# Altium schematic sheet Schematic-Altium.schdoc
size 677 x 232 mm
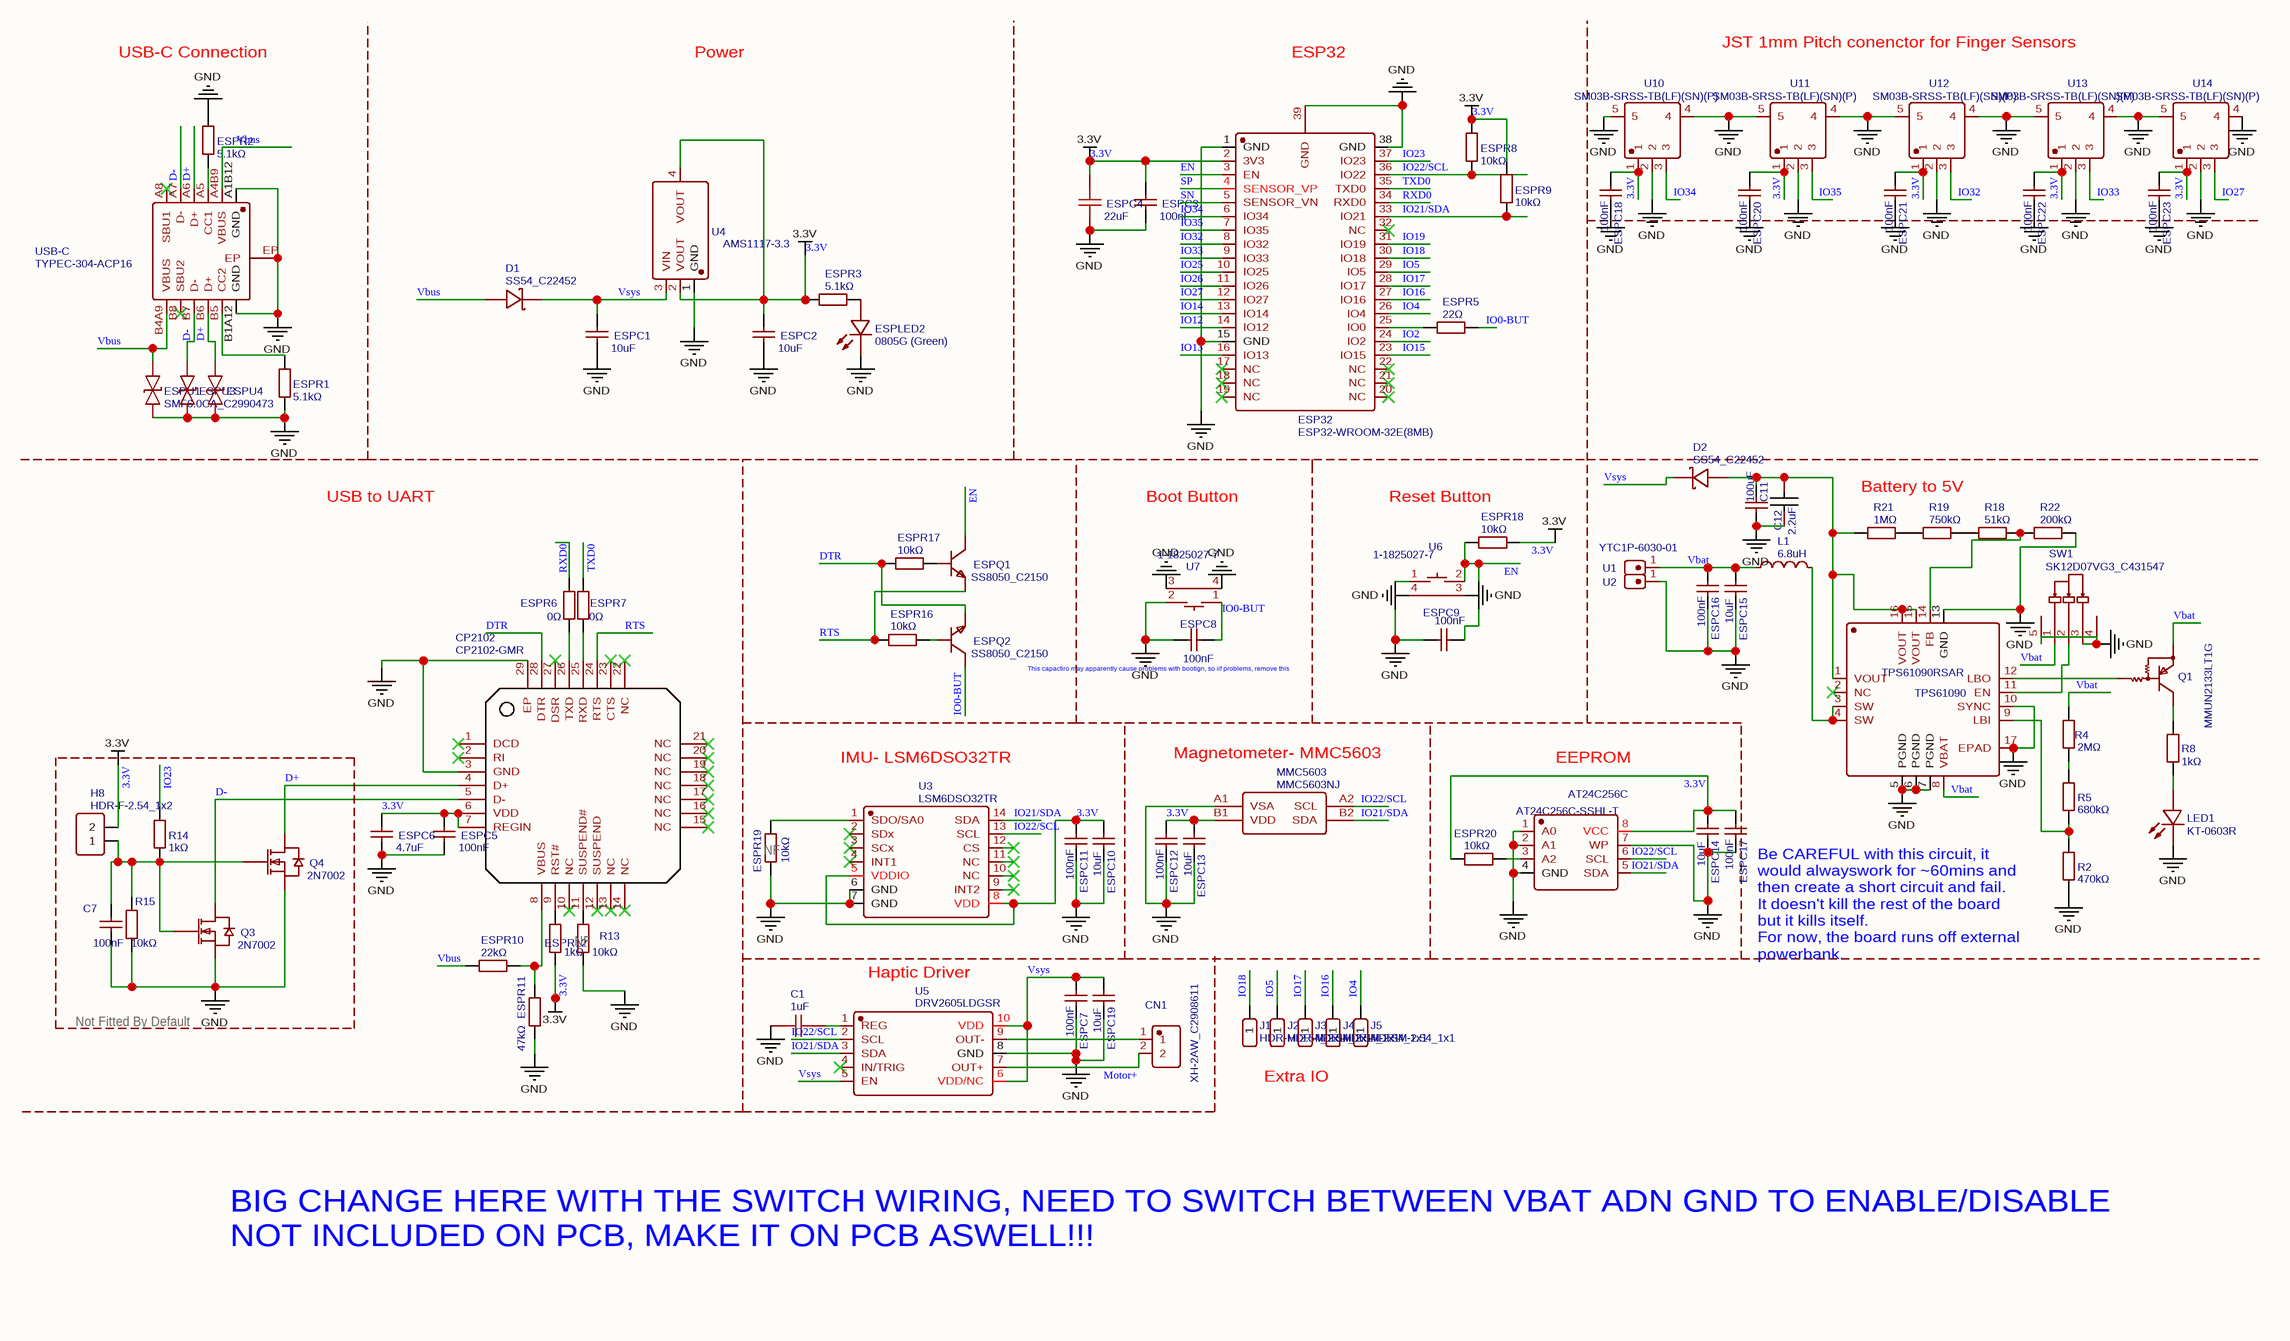
[diagram p0: Schematic-Altium.schdoc]

## Parts
AT24C256C  AT24C256C-SSHL-T  [SOIC-8_L4.9-W3.9-P1.27-LS6.0-BL]
C1  1uF  [C0402]
C7  100nF  [C0402]
C11  100uF  [C1206]
C12  2.2uF  [C0402]
CN1  XH-2AW_C2908611  [CONN-TH_XH-2AW_C2908611]
CP2102  CP2102-GMR  [WQFN-28_L5.0-W5.0-P0.50-BL-EP3.2]
D1  SS54_C22452  [SMA_L4.4-W2.8-LS5.4-R-RD]
D2  SS54_C22452  [SMA_L4.4-W2.8-LS5.4-R-RD]
ESP32  ESP32-WROOM-32E(8MB)  [WIFI-SMD_ESP32-WROOM-32E]
ESPC1  10uF  [C0402]
ESPC2  10uF  [C0402]
ESPC3  100nF  [C0402]
ESPC4  22uF  [C0603]
ESPC5  100nF  [C0402]
ESPC6  4.7uF  [C0402]
ESPC7  100nF  [C0402]
ESPC8  100nF  [C0402]
ESPC9  100nF  [C0402]
ESPC10  10uF  [C0402]
ESPC11  100nF  [C0402]
ESPC12  100nF  [C0402]
ESPC13  10uF  [C0402]
ESPC14  10uF  [C0402]
ESPC15  10uF  [C0402]
ESPC16  100nF  [C0402]
ESPC17  100nF  [C0402]
ESPC18  100nF  [C0402]
ESPC19  10uF  [C0402]
ESPC20  100nF  [C0402]
ESPC21  100nF  [C0402]
ESPC22  100nF  [C0402]
ESPC23  100nF  [C0402]
ESPLED2  0805G (Green)  [LED0805-R-RD]
ESPQ1  SS8050_C2150  [SOT-23-3_L2.9-W1.3-P1.90-LS2.4-BR]
ESPQ2  SS8050_C2150  [SOT-23-3_L2.9-W1.3-P1.90-LS2.4-BR]
ESPR1  5.1kΩ  [R0402]
ESPR2  5.1kΩ  [R0402]
ESPR3  5.1kΩ  [R0402]
ESPR5  22Ω  [R0402]
ESPR6  0Ω  [R0402]
ESPR7  0Ω  [R0402]
ESPR8  10kΩ  [R0402]
ESPR9  10kΩ  [R0402]
ESPR10  22kΩ  [R0402]
ESPR11  47kΩ  [R0402]
ESPR12  1kΩ  [R0402]
ESPR16  10kΩ  [R0402]
ESPR17  10kΩ  [R0402]
ESPR18  10kΩ  [R0402]
ESPR19  10kΩ  [R0402]
ESPR20  10kΩ  [R0402]
ESPU1  SMF6.0CA_C2990473  [SOD-123FL_L2.8-W1.8-LS3.7-BI]
ESPU3  SMF6.0CA_C2990473  [SOD-123FL_L2.8-W1.8-LS3.7-BI]  (value not drawn)
ESPU4  SMF6.0CA_C2990473  [SOD-123FL_L2.8-W1.8-LS3.7-BI]  (value not drawn)
H8  HDR-F-2.54_1x2  [HDR-F-2.54_1X2]
J1  HDR-M-2.54_1x1  [HDR-M-2.54_1X1]
J2  HDR-M-2.54_1x1  [HDR-M-2.54_1X1]
J3  HDR-M-2.54_1x1  [HDR-M-2.54_1X1]
J4  HDR-M-2.54_1x1  [HDR-M-2.54_1X1]
J5  HDR-M-2.54_1x1  [HDR-M-2.54_1X1]
L1  6.8uH  [IND-SMD_L4.5-W4.5_SMMS0420]
LED1  KT-0603R  [LED0603-RD]
MMC5603  MMC5603NJ  [FLIPCHIP-4_L0.8-W0.8-R2-C2-P0.40-TL]
Q1  MMUN2133LT1G  [SOT-23-3_L2.9-W1.6-P1.90-LS2.8-BR]
Q3  2N7002  [SOT-23-3_L2.9-W1.3-P1.90-LS2.4-BR]
Q4  2N7002  [SOT-23-3_L2.9-W1.3-P1.90-LS2.4-BR]
R2  470kΩ  [R0402]
R4  2MΩ  [R0603]
R5  680kΩ  [R0603]
R8  1kΩ  [R0402]
R13  10kΩ  [R0402]
R14  1kΩ  [R0402]
R15  10kΩ  [R0402]
R18  51kΩ  [R0402]
R19  750kΩ  [R0603]
R21  1MΩ  [R0402]
R22  200kΩ  [R0402]
SW1  SK12D07VG3_C431547  [SW-TH_SK12D07VG3]
TPS61090  TPS61090RSAR  [QFN-16_L4.0-W4.0-P0.65-BL-EP2.2]
U1  YTC1P-6030-01  [CONN-SMD_YTC1P-3015-01]
U2  YTC1P-6030-01  [CONN-SMD_YTC1P-3015-01]  (value not drawn)
U3  LSM6DSO32TR  [LGA-14_L3.0-W2.5-P0.50-TL]
U4  AMS1117-3.3  [SOT-223-3_L6.5-W3.4-P2.30-LS7.0-BR]
U5  DRV2605LDGSR  [VSSOP-10_L3.0-W3.0-P0.50-LS4.9-BL]
U6  1-1825027-7  [SW-TH_KH-6X6X4.3H-ZJ]
U7  1-1825027-7  [SW-TH_KH-6X6X4.3H-ZJ]
U10  SM03B-SRSS-TB(LF)(SN)(P)  [CONN-SMD_SM03B-SRSS-TB-LF-SN-P]
U11  SM03B-SRSS-TB(LF)(SN)(P)  [CONN-SMD_SM03B-SRSS-TB-LF-SN-P]
U12  SM03B-SRSS-TB(LF)(SN)(P)  [CONN-SMD_SM03B-SRSS-TB-LF-SN-P]
U13  SM03B-SRSS-TB(LF)(SN)(P)  [CONN-SMD_SM03B-SRSS-TB-LF-SN-P]
U14  SM03B-SRSS-TB(LF)(SN)(P)  [CONN-SMD_SM03B-SRSS-TB-LF-SN-P]
USB-C  TYPEC-304-ACP16  [USB-C-SMD_TYPE-C-16P-1]

## Blocks framed on the sheet
Not Fitted By Default: C7 H8 Q3 Q4 R14 R15

## Nets
3.3V: AT24C256C.8(VCC) CP2102.6(VDD) CP2102.7(REGIN) ESP32.2(3V3) ESPC2.2 ESPC3.2 ESPC4.2 ESPC5.2 ESPC6.2 ESPC10.2 ESPC11.1 ESPC12.1 ESPC13.2 ESPC14.2 ESPC17.1 ESPC18.1 ESPC20.1 ESPC21.1 ESPC22.1 ESPC23.1 ESPR3.2 ESPR8.2 ESPR9.2 ESPR12.1 ESPR18.1 ESPR20.2 H8.2 MMC5603.B1(VDD) U3.5(VDDIO) U3.8(VDD) U4.2(VOUT) U4.4(VOUT) U10.1 U11.1 U12.1 U13.1 U14.1
GND: AT24C256C.1(A0) AT24C256C.2(A1) AT24C256C.4(GND) AT24C256C.7(WP) C1.1 C7.1 C11.1 C12.1 CP2102.3(GND) CP2102.29(EP) ESP32.1(GND) ESP32.15(GND) ESP32.38(GND) ESP32.39(GND) ESPC1.1 ESPC2.1 ESPC3.1 ESPC4.1 ESPC5.1 ESPC6.1 ESPC7.2 ESPC8.1 ESPC9.1 ESPC10.1 ESPC11.2 ESPC12.2 ESPC13.1 ESPC14.1 ESPC15.1 ESPC16.2 ESPC17.2 ESPC18.2 ESPC19.1 ESPC20.2 ESPC21.2 ESPC22.2 ESPC23.2 ESPLED2.2(K) ESPR1.1 ESPR2.2 ESPR11.1 ESPR19.1 ESPU1.1 ESPU3.1 ESPU4.1 LED1.1(K) MMC5603.A1(VSA) Q3.2(S) Q4.2(S) R2.1 R13.1 R15.1 R22.2 SW1.3 SW1.4 SW1.5 TPS61090.5(PGND) TPS61090.6(PGND) TPS61090.7(PGND) TPS61090.10(SYNC) TPS61090.13(GND) TPS61090.17(EPAD) U2.1 U3.6(GND) U3.7(GND) U4.1(GND) U5.8(GND) U6.1 U6.3 U6.4 U7.2 U7.3 U7.4 U10.2 U10.4 U10.5 U11.2 U11.4 U11.5 U12.2 U12.4 U12.5 U13.2 U13.4 U13.5 U14.2 U14.4 U14.5 USB-C.A1B12(GND) USB-C.B1A12(GND) USB-C.EP
D+: CP2102.4(D+) ESPU4.2 Q4.3(D) USB-C.A6(D+) USB-C.B6(D+)
D-: CP2102.5(D-) ESPU3.2 Q3.3(D) USB-C.A7(D-) USB-C.B7(D-)
DTR: CP2102.28(DTR) ESPQ2.2(E) ESPR17.2
EN: ESP32.3(EN) ESPC9.2 ESPQ1.3(C) ESPR18.2 U6.2
IO0-BUT: ESPC8.2 ESPQ2.3(C) ESPR5.2 U7.1
IO2: ESP32.24(IO2)
IO4: ESP32.26(IO4) J5.1
IO5: ESP32.29(IO5) J2.1
IO12: ESP32.14(IO12)
IO13: ESP32.16(IO13)
IO14: ESP32.13(IO14)
IO15: ESP32.23(IO15)
IO16: ESP32.27(IO16) J4.1
IO17: ESP32.28(IO17) J3.1
IO18: ESP32.30(IO18) J1.1
IO19: ESP32.31(IO19)
IO21/SDA: AT24C256C.5(SDA) ESP32.33(IO21) ESPR9.1 MMC5603.B2(SDA) U3.14(SDA) U5.3(SDA)
IO22/SCL: AT24C256C.6(SCL) ESP32.36(IO22) ESPR8.1 MMC5603.A2(SCL) U3.13(SCL) U5.2(SCL)
IO23: ESP32.37(IO23) R14.2
IO25: ESP32.10(IO25)
IO26: ESP32.11(IO26)
IO27: ESP32.12(IO27) U14.3
IO32: ESP32.8(IO32) U12.3
IO33: ESP32.9(IO33) U13.3
IO34: ESP32.6(IO34) U10.3
IO35: ESP32.7(IO35) U11.3
Motor+: CN1.2 U5.7(OUT+)
RTS: CP2102.24(RTS) ESPQ1.2(E) ESPR16.2
RXD0: ESP32.34(RXD0) ESPR6.2
SN: ESP32.5(SENSOR_VN)
SP: ESP32.4(SENSOR_VP)
TXD0: ESP32.35(TXD0) ESPR7.2
Vbat: ESPC15.2 ESPC16.1 L1.1 Q1.2(E) R4.2 SW1.1 TPS61090.8(VBAT) U1.1
Vbus: D1.1(A) ESPR10.1 ESPU1.2 USB-C.A4B9(VBUS) USB-C.B4A9(VBUS)
Vsys: D1.2(K) D2.2(K) ESPC1.2 ESPC7.1 ESPC19.2 U4.3(VIN) U5.5(EN) U5.6(VDD/NC) U5.10(VDD)
NetAT24C256C_3: AT24C256C.3(A2) ESPR20.1
NetC1_2: C1.2 U5.1(REG)
NetC7_2: C7.2 H8.1 Q3.1(G) Q4.1(G) R14.1 R15.2
NetC11_2: C11.2 C12.2 D2.1(A) R21.1 TPS61090.1(VOUT) TPS61090.15(VOUT) TPS61090.16(VOUT)
NetCN1_1: CN1.1 U5.9(OUT-)
NetCP2102_8: CP2102.8(VBUS) ESPR10.2 ESPR11.2
NetCP2102_9: CP2102.9(RST#) ESPR12.2
NetCP2102_11: CP2102.11(SUSPEND#) R13.2
NetCP2102_25: CP2102.25(RXD) ESPR7.1
NetCP2102_26: CP2102.26(TXD) ESPR6.1
NetESP32_25: ESP32.25(IO0) ESPR5.1
NetESPLED2_1: ESPLED2.1(A) ESPR3.1
NetESPQ1_1: ESPQ1.1(B) ESPR17.1
NetESPQ2_1: ESPQ2.1(B) ESPR16.1
NetESPR1_2: ESPR1.2 USB-C.B5(CC2)
NetESPR2_1: ESPR2.1 USB-C.A5(CC1)
NetESPR19_2: ESPR19.2 U3.1(SDO/SA0)
NetL1_2: L1.2 TPS61090.3(SW) TPS61090.4(SW)
NetLED1_2: LED1.2(A) R8.1
NetQ1_1: Q1.1(B) TPS61090.12(LBO)
NetQ1_3: Q1.3(C) R8.2
NetR2_2: R2.2 R5.1 TPS61090.9(LBI)
NetR4_1: R4.1 R5.2
NetR18_1: R18.1 R19.2
NetR18_2: R18.2 R22.1 TPS61090.14(FB)
NetR19_1: R19.1 R21.2
NetSW1_2: SW1.2 TPS61090.11(EN)

Not connected (* = marked no-connect by the designer): CP2102 1(DCD)* 2(RI)* 10(NC)* 12(SUSPEND)* 13(NC)* 14(NC)* 15(NC)* 16(NC)* 17(NC)* 18(NC)* 19(NC)* 20(NC)* 21(NC)* 22(NC)* 23(CTS)* 27(DSR)*; ESP32 17(NC)* 18(NC)* 19(NC)* 20(NC)* 21(NC)* 22(NC)* 32(NC)*; TPS61090 2(NC)*; U3 2(SDx)* 3(SCx)* 4(INT1)* 9(INT2)* 10(NC)* 11(NC)* 12(CS)*; U5 4(IN/TRIG)*; USB-C A8(SBU1)* B8(SBU2)*

## Notes on the sheet
- USB-C Connection
- Power
- ESP32
- JST 1mm Pitch conenctor for Finger Sensors
- USB to UART
- Boot Button
- (near ESPR18) Reset Button
- Battery to 5V
- (near ESPC8) This capactiro may apparently cause problems with bootign, so iif problems, remove this
- (near U3) IMU- LSM6DSO32TR
- (near MMC5603) Magnetometer- MMC5603
- EEPROM
- (near ESPC17) Be CAREFUL with this circuit, it
  would alwayswork for ~60mins and
  then create a short circuit and fail.
  It doesn't kill the rest of the board
  but it kills itself.
  For now, the board runs off external
  powerbank.
- (near ESPR19) NF
- (near R13) NF
- Haptic Driver
- Extra IO
- BIG CHANGE HERE WITH THE SWITCH WIRING, NEED TO SWITCH BETWEEN VBAT ADN GND TO ENABLE/DISABLE
  NOT INCLUDED ON PCB, MAKE IT ON PCB ASWELL!!!

## Library data of the parts
AT24C256C = AT24C256C-SSHL-T: Manufacturer: MICROCHIP(美国微芯); Supplier: LCSC; Manufacturer Part: AT24C256C-SSHL-T; Supplier Part: C6482; JLCPCB Part Class: Basic Part; link: https://lcsc.com/eda_search?q=C6482&%26type=1&ref=editor; spicePre: U; spiceSymbolName: AT24C256C-SSHL-T
C1 = 1uF: Manufacturer: SAMSUNG(三星); Manufacturer Part: CL05A105KA5NQNC; nameAlias: Value; Supplier: LCSC; Supplier Part: C52923; JLCPCB Part Class: Basic Part; link: https://lcsc.com/eda_search?q=C52923&%26type=1&ref=editor; spicePre: C; spiceSymbolName: CL05A105KA5NQNC
C7 ESPC3 ESPC5 ESPC7-ESPC9 ESPC11 ESPC12 ESPC16-ESPC18 ESPC20-ESPC23 = 100nF: Manufacturer Part: CL05B104KO5NNNC; Manufacturer: SAMSUNG(三星); nameAlias: Value; Supplier: LCSC; Supplier Part: C1525; JLCPCB Part Class: Basic Part; link: https://lcsc.com/eda_search?q=C1525&%26type=1&ref=editor; spicePre: C; spiceSymbolName: CL05B104KO5NNNC
C11 = 100uF: Manufacturer Part: CL31A107MQHNNNE; Manufacturer: SAMSUNG(三星); nameAlias: Value; Supplier: LCSC; Supplier Part: C15008; JLCPCB Part Class: Basic Part; link: https://lcsc.com/eda_search?q=C15008&%26type=1&ref=editor; spicePre: C; spiceSymbolName: CL31A107MQHNNNE
C12 = 2.2uF: Manufacturer Part: CL05A225MQ5NSNC; Manufacturer: SAMSUNG(三星); nameAlias: Value; Supplier: LCSC; Supplier Part: C12530; JLCPCB Part Class: Basic Part; link: https://lcsc.com/eda_search?q=C12530&%26type=1&ref=editor; spicePre: C; spiceSymbolName: CL05A225MQ5NSNC
CN1 = XH-2AW_C2908611: Manufacturer: HCTL(华灿天禄); Manufacturer Part: XH-2AW; Contributor: LCSC; Supplier: LCSC; Supplier Part: C2908611; JLCPCB Part Class: Extended Part; link: https://lcsc.com/eda_search?q=C2908611&%26type=1&ref=editor; spicePre: C; spiceSymbolName: XH-2AW_C2908611
CP2102 = CP2102-GMR: Manufacturer: SILICON LABS(芯科); Supplier: LCSC; Manufacturer Part: CP2102-GMR; Supplier Part: C6568; JLCPCB Part Class: Basic Part; link: https://lcsc.com/eda_search?q=C6568&%26type=1&ref=editor; spicePre: U; spiceSymbolName: CP2102-GMR
D1 D2 = SS54_C22452: Manufacturer Part: SS54; Manufacturer: MDD; Supplier: LCSC; Supplier Part: C22452; JLCPCB Part Class: Basic Part; link: https://lcsc.com/eda_search?q=C22452&%26type=1&ref=editor; spicePre: D; spiceSymbolName: SS54_C22452
ESP32 = ESP32-WROOM-32E(8MB): Manufacturer: ESPRESSIF(乐鑫); Manufacturer Part: ESP32-WROOM-32E-N8; Contributor: LCSC; Supplier: LCSC; Supplier Part: C701342; JLCPCB Part Class: Extended Part; link: https://lcsc.com/eda_search?q=C701342&%26type=1&ref=editor; spicePre: U; spiceSymbolName: ESP32-WROOM-32E(8MB)
ESPC1 ESPC2 ESPC10 ESPC13-ESPC15 ESPC19 = 10uF: Manufacturer Part: CL05A106MQ5NUNC; Manufacturer: SAMSUNG(三星); nameAlias: Value; Supplier: LCSC; Supplier Part: C15525; JLCPCB Part Class: Basic Part; link: https://lcsc.com/eda_search?q=C15525&%26type=1&ref=editor; spicePre: C; spiceSymbolName: CL05A106MQ5NUNC
ESPC4 = 22uF: Manufacturer: SAMSUNG(三星); Manufacturer Part: CL10A226MQ8NRNC; nameAlias: Value; Supplier: LCSC; Supplier Part: C59461; JLCPCB Part Class: Basic Part; link: https://lcsc.com/eda_search?q=C59461&%26type=1&ref=editor; spicePre: C; spiceSymbolName: CL10A226MQ8NRNC
ESPC6 = 4.7uF: Manufacturer Part: CL05A475MP5NRNC; Manufacturer: SAMSUNG(三星); nameAlias: Value; Supplier: LCSC; Supplier Part: C23733; JLCPCB Part Class: Basic Part; link: https://lcsc.com/eda_search?q=C23733&%26type=1&ref=editor; spicePre: C; spiceSymbolName: CL05A475MP5NRNC
ESPLED2 = 0805G (Green): Manufacturer: KENTO; Manufacturer Part: KT-0805翠绿; Supplier: LCSC; Supplier Part: C2297; JLCPCB Part Class: Basic Part; link: https://lcsc.com/eda_search?q=C2297&%26type=1&ref=editor; spicePre: L; spiceSymbolName: 0805G (Green)
ESPQ1 ESPQ2 = SS8050_C2150: Manufacturer: CJ(江苏长电/长晶); Manufacturer Part: SS8050; Supplier: LCSC; Supplier Part: C2150; JLCPCB Part Class: Basic Part; link: https://lcsc.com/eda_search?q=C2150&%26type=1&ref=editor; spicePre: Q; spiceSymbolName: SS8050_C2150
ESPR1-ESPR3 = 5.1kΩ: Manufacturer: UNI-ROYAL(厚声); Manufacturer Part: 0402WGF5101TCE; nameAlias: Value; Supplier: LCSC; Supplier Part: C25905; JLCPCB Part Class: Basic Part; link: https://lcsc.com/eda_search?q=C25905&%26type=1&ref=editor; spicePre: R; spiceSymbolName: 0402WGF5101TCE
ESPR5 = 22Ω: Manufacturer: UNI-ROYAL(厚声); Manufacturer Part: 0402WGF220JTCE; nameAlias: Value; Supplier: LCSC; Supplier Part: C25092; JLCPCB Part Class: Basic Part; link: https://lcsc.com/eda_search?q=C25092&%26type=1&ref=editor; spicePre: R; spiceSymbolName: 0402WGF220JTCE
ESPR6 ESPR7 = 0Ω: Manufacturer: UNI-ROYAL(厚声); Manufacturer Part: 0402WGF0000TCE; nameAlias: Value; Supplier: LCSC; Supplier Part: C17168; JLCPCB Part Class: Basic Part; link: https://lcsc.com/eda_search?q=C17168&%26type=1&ref=editor; spicePre: R; spiceSymbolName: 0402WGF0000TCE
ESPR8 ESPR9 ESPR16-ESPR20 R13 R15 = 10kΩ: Manufacturer: UNI-ROYAL(厚声); Manufacturer Part: 0402WGF1002TCE; nameAlias: Value; Supplier: LCSC; Supplier Part: C25744; JLCPCB Part Class: Basic Part; link: https://lcsc.com/eda_search?q=C25744&%26type=1&ref=editor; spicePre: R; spiceSymbolName: 0402WGF1002TCE
ESPR10 = 22kΩ: Manufacturer: UNI-ROYAL(厚声); Manufacturer Part: 0402WGF2202TCE; nameAlias: Value; Supplier: LCSC; Supplier Part: C25768; JLCPCB Part Class: Basic Part; link: https://lcsc.com/eda_search?q=C25768&%26type=1&ref=editor; spicePre: R; spiceSymbolName: 0402WGF2202TCE
ESPR11 = 47kΩ: Manufacturer: UNI-ROYAL(厚声); Manufacturer Part: 0402WGF4702TCE; nameAlias: Value; Supplier: LCSC; Supplier Part: C25792; JLCPCB Part Class: Basic Part; link: https://lcsc.com/eda_search?q=C25792&%26type=1&ref=editor; spicePre: R; spiceSymbolName: 0402WGF4702TCE
ESPR12 R8 R14 = 1kΩ: Manufacturer: UNI-ROYAL(厚声); Manufacturer Part: 0402WGF1001TCE; nameAlias: Value; Supplier: LCSC; Supplier Part: C11702; JLCPCB Part Class: Basic Part; link: https://lcsc.com/eda_search?q=C11702&%26type=1&ref=editor; spicePre: R; spiceSymbolName: 0402WGF1001TCE
ESPU1 ESPU3 ESPU4 = SMF6.0CA_C2990473: Manufacturer: Liown(里阳半导体); Contributor: lcsc; Supplier: LCSC; Supplier Part: C2990473; Manufacturer Part: SMF6.0CA; JLCPCB Part Class: Basic Part; link: https://lcsc.com/eda_search?q=C2990473&%26type=1&ref=editor; spicePre: U; spiceSymbolName: SMF6.0CA_C2990473
H8 = HDR-F-2.54_1x2: Contributor: LCEDA_Lib; Supplier Part: C49661; Supplier: LCSC; spicePre: H; spiceSymbolName: HDR-F-2.54_1x2
J1-J5 = HDR-M-2.54_1x1: Contributor: LCEDA_Lib; Supplier Part: C81276; Supplier: LCSC; spicePre: J; spiceSymbolName: HDR-M-2.54_1x1
L1 = 6.8uH: Manufacturer: SXN(顺翔诺); Manufacturer Part: SMMS0420-6R8M; nameAlias: Value; Contributor: LCSC; Supplier: LCSC; Supplier Part: C133194; JLCPCB Part Class: Extended Part; link: https://lcsc.com/eda_search?q=C133194&%26type=1&ref=editor; spicePre: L; spiceSymbolName: SMMS0420-6R8M
LED1 = KT-0603R: Manufacturer: KENTO; Supplier: LCSC; Manufacturer Part: KT-0603R; Supplier Part: C2286; JLCPCB Part Class: Basic Part; link: https://lcsc.com/eda_search?q=C2286&%26type=1&ref=editor; spicePre: L; spiceSymbolName: KT-0603R
MMC5603 = MMC5603NJ: Manufacturer: MEMSIC(美新); Contributor: LCSC; Supplier: Mouser; Supplier Part: C404328; Manufacturer Part: MMC5603NJ; JLCPCB Part Class: Extended Part; link: https://lcsc.com/eda_search?q=C404328&%26type=1&ref=editor; spicePre: U; spiceSymbolName: MMC5603NJ
Q1 = MMUN2133LT1G: Manufacturer: onsemi(安森美); Supplier: LCSC; Manufacturer Part: MMUN2133LT1G; Supplier Part: C86182; JLCPCB Part Class: Extended Part; link: https://lcsc.com/eda_search?q=C86182&%26type=1&ref=editor; spicePre: Q; spiceSymbolName: MMUN2133LT1G
Q3 Q4 = 2N7002: Manufacturer: CJ(江苏长电/长晶); Supplier: LCSC; Manufacturer Part: 2N7002; Supplier Part: C8545; JLCPCB Part Class: Basic Part; link: https://lcsc.com/eda_search?q=C8545&%26type=1&ref=editor; spicePre: Q; spiceSymbolName: 2N7002
R2 = 470kΩ: Manufacturer: UNI-ROYAL(厚声); Manufacturer Part: 0402WGF4703TCE; nameAlias: Value; Supplier: LCSC; Supplier Part: C25790; JLCPCB Part Class: Basic Part; link: https://lcsc.com/eda_search?q=C25790&%26type=1&ref=editor; spicePre: R; spiceSymbolName: 0402WGF4703TCE
R4 = 2MΩ: Manufacturer: UNI-ROYAL(厚声); Manufacturer Part: 0603WAF2004T5E; nameAlias: Value; Supplier: LCSC; Supplier Part: C22976; JLCPCB Part Class: Basic Part; link: https://lcsc.com/eda_search?q=C22976&%26type=1&ref=editor; spicePre: R; spiceSymbolName: 0603WAF2004T5E
R5 = 680kΩ: Manufacturer: UNI-ROYAL(厚声); Manufacturer Part: 0603WAF6803T5E; nameAlias: Value; Supplier: LCSC; Supplier Part: C25822; JLCPCB Part Class: Basic Part; link: https://lcsc.com/eda_search?q=C25822&%26type=1&ref=editor; spicePre: R; spiceSymbolName: 0603WAF6803T5E
R18 = 51kΩ: Manufacturer: UNI-ROYAL(厚声); Manufacturer Part: 0402WGF5102TCE; nameAlias: Value; Supplier: LCSC; Supplier Part: C25794; JLCPCB Part Class: Basic Part; link: https://lcsc.com/eda_search?q=C25794&%26type=1&ref=editor; spicePre: R; spiceSymbolName: 0402WGF5102TCE
R19 = 750kΩ: Manufacturer: UNI-ROYAL(厚声); Manufacturer Part: 0603WAF7503T5E; nameAlias: Value; Supplier: LCSC; Supplier Part: C23240; JLCPCB Part Class: Basic Part; link: https://lcsc.com/eda_search?q=C23240&%26type=1&ref=editor; spicePre: R; spiceSymbolName: 0603WAF7503T5E
R21 = 1MΩ: Manufacturer: UNI-ROYAL(厚声); Manufacturer Part: 0402WGF1004TCE; nameAlias: Value; Supplier: LCSC; Supplier Part: C26083; JLCPCB Part Class: Basic Part; link: https://lcsc.com/eda_search?q=C26083&%26type=1&ref=editor; spicePre: R; spiceSymbolName: 0402WGF1004TCE
R22 = 200kΩ: Manufacturer: UNI-ROYAL(厚声); Manufacturer Part: 0402WGF2003TCE; nameAlias: Value; Supplier: LCSC; Supplier Part: C25764; JLCPCB Part Class: Basic Part; link: https://lcsc.com/eda_search?q=C25764&%26type=1&ref=editor; spicePre: R; spiceSymbolName: 0402WGF2003TCE
SW1 = SK12D07VG3_C431547: Manufacturer: SHOU HAN; Contributor: LCSC; Supplier: LCSC; Supplier Part: C431547; Manufacturer Part: SK12D07VG3; JLCPCB Part Class: Extended Part; spicePre: S; spiceSymbolName: SK12D07VG3_C431547
TPS61090 = TPS61090RSAR: Manufacturer: TI(德州仪器); Contributor: LCSC; Supplier: LCSC; Supplier Part: C206167; Manufacturer Part: TPS61090RSAR; JLCPCB Part Class: Extended Part; link: https://lcsc.com/eda_search?q=C206167&%26type=1&ref=editor; spicePre: U; spiceSymbolName: TPS61090RSAR
U1 U2 = YTC1P-6030-01: Manufacturer: YIYUAN(怡远); Contributor: lcsc; Supplier: LCSC; Supplier Part: C5221285; Manufacturer Part: YTC1P-6030-01; JLCPCB Part Class: Extended Part; spicePre: U; spiceSymbolName: YTC1P-6030-01
U3 = LSM6DSO32TR: Manufacturer: ST(意法半导体); Contributor: LCSC; Supplier: LCSC; Supplier Part: C1864162; Manufacturer Part: LSM6DSO32TR; JLCPCB Part Class: Extended Part; link: https://lcsc.com/eda_search?q=C1864162&%26type=1&ref=editor; spicePre: U; spiceSymbolName: LSM6DSO32TR
U4 = AMS1117-3.3: Manufacturer: AMS; sourceId: dwIGgezVh; timeStamp: 1476261164; Supplier: LCSC; Manufacturer Part: AMS1117-3.3; Supplier Part: C6186; JLCPCB Part Class: Basic Part; link: https://lcsc.com/eda_search?q=C6186&%26type=1&ref=editor; spicePre: U; spiceSymbolName: AMS1117-3.3
U5 = DRV2605LDGSR: Manufacturer: TI(德州仪器); Contributor: LCSC; Supplier: LCSC; Supplier Part: C527464; Manufacturer Part: DRV2605LDGSR; JLCPCB Part Class: Extended Part; link: https://lcsc.com/eda_search?q=C527464&%26type=1&ref=editor; spicePre: U; spiceSymbolName: DRV2605LDGSR
U6 U7 = 1-1825027-7: Manufacturer: TE Connectivity(美国泰科); Contributor: lcsc; Supplier: LCSC; Supplier Part: C592923; Manufacturer Part: 1-1825027-7; JLCPCB Part Class: Extended Part; link: https://lcsc.com/eda_search?q=C592923&%26type=1&ref=editor; spicePre: U; spiceSymbolName: 1-1825027-7
U10-U14 = SM03B-SRSS-TB(LF)(SN)(P): Manufacturer: JST; Contributor: LCSC; Supplier: LCSC; Supplier Part: C160403; Manufacturer Part: SM03B-SRSS-TB(LF)(SN); JLCPCB Part Class: Extended Part; link: https://lcsc.com/eda_search?q=C160403&%26type=1&ref=editor; spicePre: U; spiceSymbolName: SM03B-SRSS-TB(LF)(SN)(P)
USB-C = TYPEC-304-ACP16: Manufacturer: XUNPU(讯普); Contributor: LCSC; Supplier: LCSC; Supplier Part: C2982555; Manufacturer Part: TYPEC-304-ACP16; JLCPCB Part Class: Extended Part; link: https://lcsc.com/eda_search?q=C2982555&%26type=1&ref=editor; spicePre: U; spiceSymbolName: TYPEC-304-ACP16